# EAGLE design SAM-M8Q GPS FeatherWing (EAGLE 8.3.2)
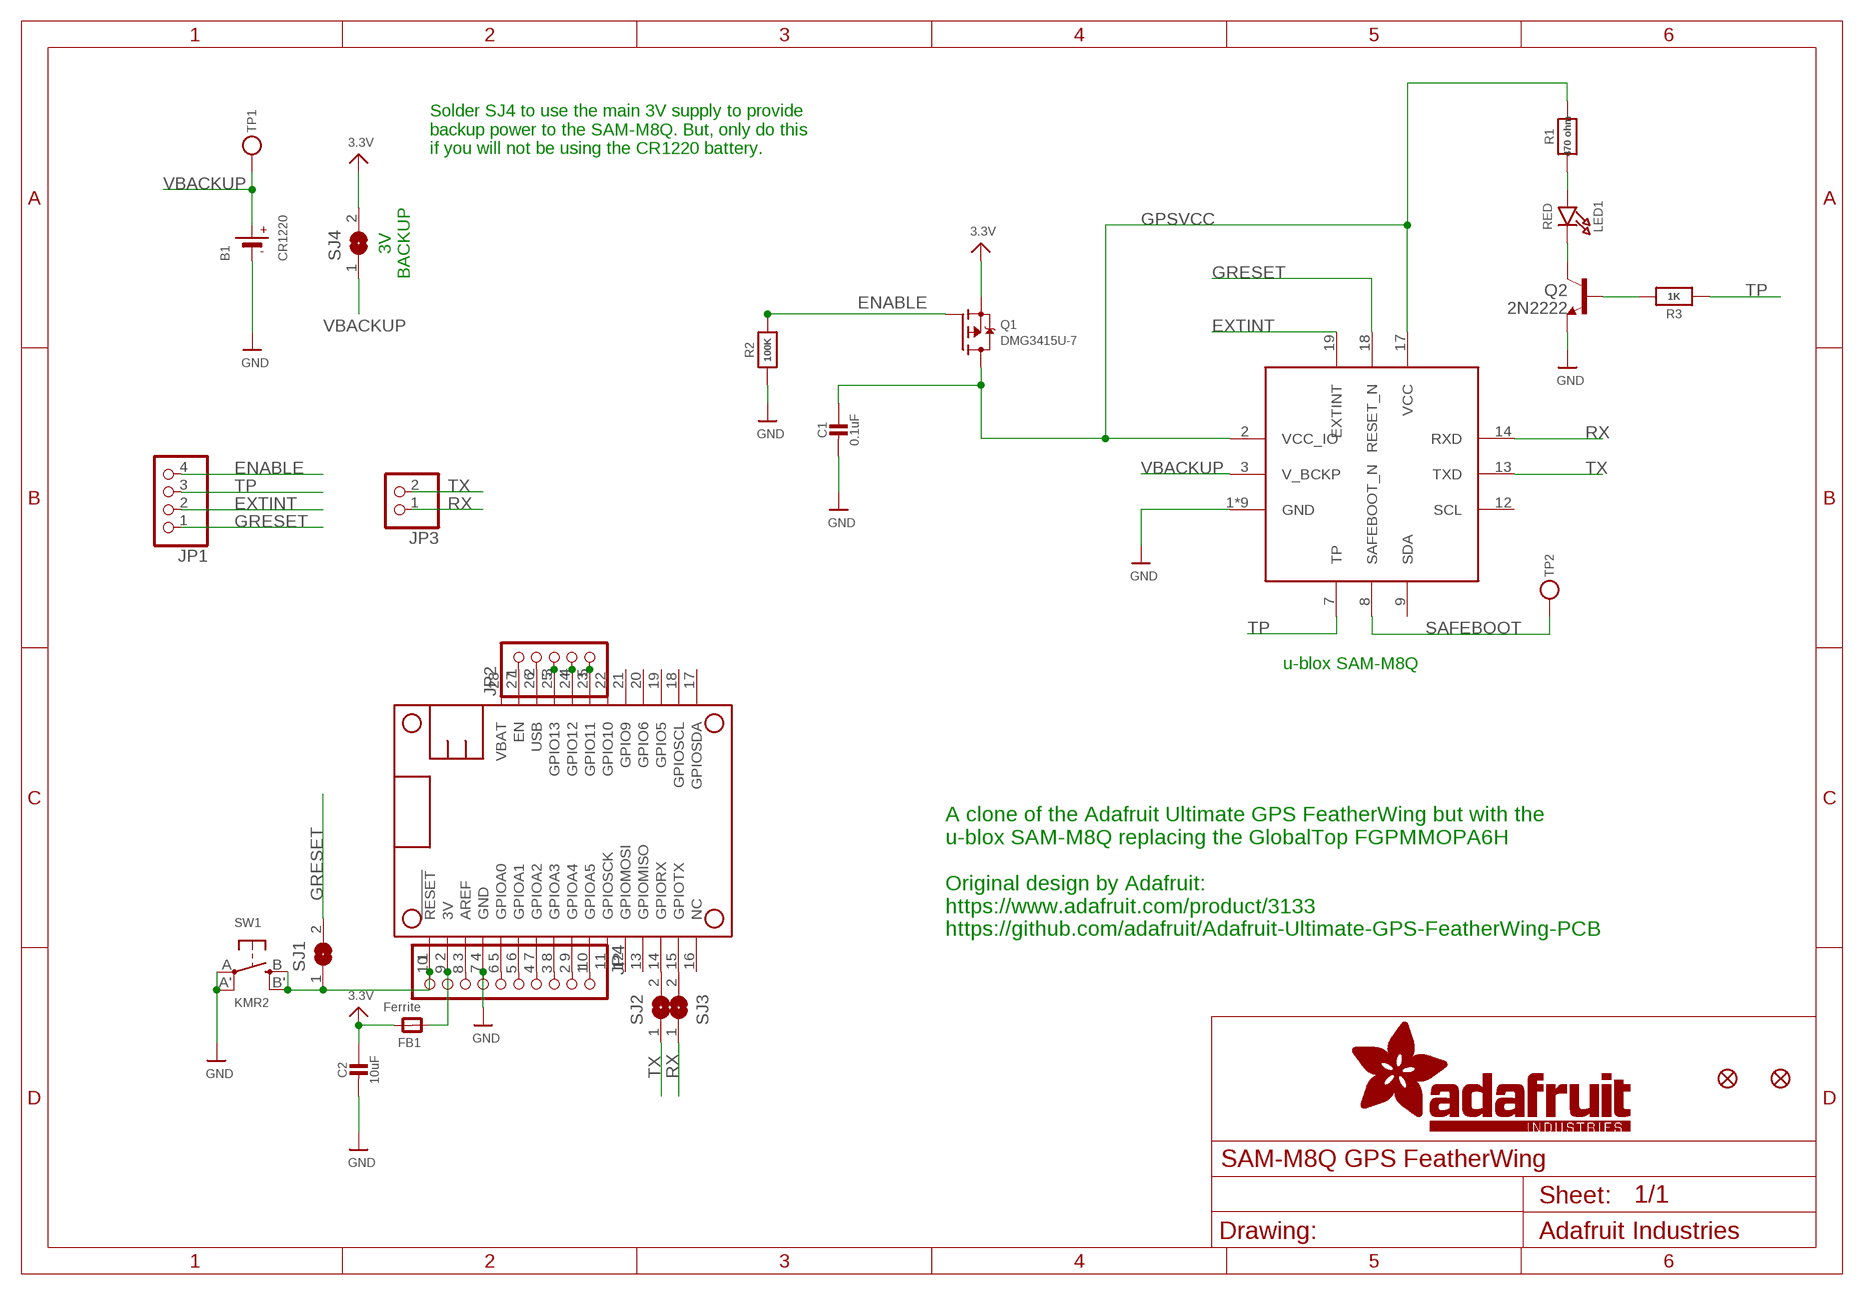
[diagram p0: schematic, sheet 1]

## Parts
B1  CR1220  BATTERYCR1220_2  [CR1220-2]
C1  0.1uF  CAP_CERAMIC0805-NOOUTLINE  [0805-NO]
C2  10uF  CAP_CERAMIC0805-NOOUTLINE  [0805-NO]
FB1  Ferrite  FERRITE-0805NO  [0805-NO]
FID1  FIDUCIAL""  [FIDUCIAL_1MM]
FID2  FIDUCIAL""  [FIDUCIAL_1MM]
JP1  HEADER-1X4ROUND  [1X04_ROUND]
JP2  HEADER-1X570MIL  [1X05_ROUND_70]
JP3  HEADER-1X2ROUND  [1X02_ROUND]
JP4  HEADER-1X10ROUND  [1X10_ROUND]
LED1  RED  LED0805_NOOUTLINE  [CHIPLED_0805_NOOUTLINE]
MS1  FEATHERWING  [FEATHERWING]
Q1  DMG3415U-7  MOSFET-PWIDE  [SOT23-WIDE]
Q2  2N2222  MMBT2222ALT1-NPN-SOT23-BEC  [SOT23-BEC]
R1  470 ohm  RESISTOR0805_NOOUTLINE  [0805-NO]
R2  100K  RESISTOR0805_NOOUTLINE  [0805-NO]
R3  1K  RESISTOR0805_NOOUTLINE  [0805-NO]
SJ1  SOLDERJUMPER  [SOLDERJUMPER_ARROW_NOPASTE]
SJ2  SOLDERJUMPERCLOSED  [SOLDERJUMPER_CLOSEDWIRE]
SJ3  SOLDERJUMPERCLOSED  [SOLDERJUMPER_CLOSEDWIRE]
SJ4  SOLDERJUMPER  [SOLDERJUMPER_ARROW_NOPASTE]
SW1  KMR2  SWITCH_TACT_SMT4.6X2.8  [BTN_KMR2_4.6X2.8]
TP1  TESTPOINTROUND1.5MM  [TESTPOINT_ROUND_1.5MM]
TP2  TESTPOINTROUND1.5MM  [TESTPOINT_ROUND_1.5MM]
U1  SAM-M8Q  [SAM-M8Q]

## Nets
3.3V: C2.1 FB1.2 Q1.2(S) SJ4.2
3V: FB1.1 JP4.9 MS1.2(3V)
ENABLE: JP1.4 Q1.1(G) R2.2
EXTINT: JP1.2 U1.19(EXTINT)
GND: B1.- C1.2 C2.2 JP4.7 MS1.4(GND) Q2.E R2.1 SW1.A'(P1) SW1.A(P) U1.1(GND) U1.4(GND) U1.5(GND) U1.6(GND) U1.10(GND) U1.11(GND) U1.15(GND) U1.16(GND) U1.20(GND)
GPSVCC: C1.1 Q1.3(D) R1.2 U1.2(VCC_IO) U1.17(VCC)
GRESET: JP1.1 SJ1.2 U1.18(RESET_N)
N$1: JP2.3 MS1.25(GPIO13)
N$2: LED1.A R1.1
N$3: JP2.4 MS1.24(GPIO12)
N$4: LED1.C Q2.C
N$5: JP2.5 MS1.23(GPIO11)
N$6: JP4.1 MS1.10(GPIOA5)
N$7: JP4.2 MS1.9(GPIOA4)
N$8: JP4.3 MS1.8(GPIOA3)
N$9: JP4.4 MS1.7(GPIOA2)
N$10: JP4.5 MS1.6(GPIOA1)
N$11: JP4.6 MS1.5(GPIOA0)
N$12: JP4.10 MS1.1(!RESET) SJ1.1 SW1.B'(S1) SW1.B(S)
N$13: JP4.8 MS1.3(AREF)
N$14: JP2.1 MS1.27(EN)
N$16: MS1.14(GPIORX) SJ2.2
N$17: MS1.15(GPIOTX) SJ3.2
N$18: Q2.B R3.2
RX: JP3.1 SJ3.1 U1.14(RXD)
SAFEBOOT: TP2.P$1 U1.8(SAFEBOOT_N)
TP: JP1.3 R3.1 U1.7(TP)
TX: JP3.2 SJ2.1 U1.13(TXD)
USB: JP2.2 MS1.26(USB)
VBACKUP: B1.+ SJ4.1 TP1.P$1 U1.3(V_BCKP)
Unconnected: MS1.11(GPIOSCK) MS1.12(GPIOMOSI) MS1.13(GPIOMISO) MS1.16(NC) MS1.17(GPIOSDA) MS1.18(GPIOSCL) MS1.19(GPIO5) MS1.20(GPIO6) MS1.21(GPIO9) MS1.22(GPIO10) MS1.28(VBAT) U1.9(SDA) U1.12(SCL)

## Notes on the sheet
- Solder SJ4 to use the main 3V supply to provide
  backup power to the SAM-M8Q. But, only do this
  if you will not be using the CR1220 battery.
- 3V
  BACKUP
- u-blox SAM-M8Q
- A clone of the Adafruit Ultimate GPS FeatherWing but with the
  u-blox SAM-M8Q replacing the GlobalTop FGPMMOPA6H
  
  Original design by Adafruit:
  https://www.adafruit.com/product/3133
  https://github.com/adafruit/Adafruit-Ultimate-GPS-FeatherWing-PCB

## Library data of the parts
B1 = microbuilder:BATTERY: CR1220 SMT - Digikey: 3001K-ND CD2032 BAT-HLD-001 - Digikey: BAT-HLD-001-ND
C1 C2 = microbuilder:CAP_CERAMIC: Ceramic Capacitors For new designs, use the packages preceded by an '_' character since they are more reliable: The following footprints should be used on most boards: _0402 - Standard footprint for regular board layouts _0603 - Standard footprint for regular board layouts _0805 - Standard footprint for regular board layouts _1206 - Standard footprint for regular board layouts For extremely tight-pitch boards where space is at a premium, the following 'micro-pitch' footprints can be used (smaller pads, no silkscreen outline, etc.): _0402MP - Micro-pitch footprint for very dense/compact boards _0603MP - Micro-pitch footprint for very dense/compact boards _0805MP - Micro-pitch footprint for very dense/compact boards _1206MP - Micro-pitch footprint for very dense/compact boards
FB1 = microbuilder:FERRITE: Ferrite Bead 0603 MMZ1608B121C - 120 Ohm @ 100MHz, 600mA, 0.15 Ohm DC Resistance - Digikey: 445-2164-1-ND BK1608HW121-T - 120 Ohm, 600mA Ferrite Chip - Digikey: 587-1876-2-ND 0805 HZ0805B272R-10 - 2.7K Ohm @ 100MHz, 200mA, 0.8 Ohm DC Resistance - Digikey: 240-2504-1-ND (see also Murata BLM21BD272SN1L) MMZ2012Y152B - 1.5K Ohm @ 100MHz, 500mA, 0.4 Ohm DC Resistance - Digikey: 445-1560-1-ND - Mainly for high frequency (80-400MHz) MMZ2012R102A - 1K Ohm @ 100MHz, 500mA, 0.3 Ohm DC Resistance - Digikey: 445-1555-2-ND - More general purpose (10-200MHz)
FID1 FID2 = microbuilder:FIDUCIAL: Fiducial Alignment Points Various fiducial points for machine vision alignment.; BOM: EXCLUDE
JP1 = microbuilder:HEADER-1X4: PIN HEADER
JP2 = microbuilder:HEADER-1X5: PIN HEADER
JP3 = microbuilder:HEADER-1X2: PIN HEADER
JP4 = microbuilder:HEADER-1X10: PIN HEADER
LED1 = microbuilder:LED: LED 0603 - 0603 Surface Mount Package 2mA: Green LED - Low Power (3.9mcd, 2ma, 1.7Vf) - Digikey: 475-2709-2-ND Orange LED - Low Power (9.8mcd, 2ma, 1.8Vf) - Digikey: 475-1194-2-ND Red LED - Low Power (5mcd, 2ma, 1.8Vf) - Digikey: 475-1195-2-ND Yellow LED - Low Power (7mcd, 2ma, 1.8Vf) - Digikey: 475-1196-2-ND 5mA: Blue LED - Low Power (17mcd, 5ma, 2.9Vf) - Digikey: LNJ937W8CRACT-ND 0805 - 0805 Surface Mount Package 2mA: Red LED (8.8mcd, 2mA, 1.8Vf, Clear) - Low Power [Digikey: 475-2510-1-ND] Green LED (5mcd, 2mA, 1.8Vf, Clear) - Low Power [Digikey: 475-2730-1-ND] Yellow LED (11.3mcd, 2mA, 1.8Vf, Clear) - Low Power [Digikey: 475-2555-1-ND] 20mA: Red LED (104mcd, 20mA, Diffused) - LS R976 [Digikey: 475-1278-6-ND] Red LED (12mcd, 20mA, 2.0Vf, Clear) - APT2012EC [Digikey: 754-1128-1-ND] Green LED (15mcd, 20mA, 2.2Vf, Clear) - APT2012GC [Digikey: 754-1131-1-ND] Orange LED (160mcd, 20mA, 2.1Vf, Clear) - APT2012SECK [Digikey: 754-1130-1-ND] 1206 - 1206 Surface Mount Package Green LED (26mcd, 20mA, Diffused) - LG N971 [Digikey: 475-1407-6-ND] Red LED (15mcd, 20mA, Diffused) - LH N974 [Digikey: 475-1416-6-ND] Cree - Cree High-Power Surface Mount LEDs XPEBWT-L1-0000-00D50 - White 111lm 350mA 2.9Vf 6200K 110° XTEAWT-00-0000-00000LEE3 - White 114lm 350mA 2.85Vf 5000K 115° Everlight - Everlight 45-21 Series Surface Mount LEDs 45-21/QK2C-B2832AC2CB2/2T - Warm White 2000mcd 20mA 3.25Vf 3050K 120° 45-21/LK2C-B38452C4CB2/2T - Nuetral White 2000mcd 20mA 3.25Vf 4150K 120° 45-21/LK2C-B50634C6CB2/2T - Cold White 2200mcd 20mA 3.25Vf 5650K 120° PLCC2 Reverse Mount LS T77K-J1L2-1-0-2-R18-Z - Red 11.25mcd 2mA 1.8Vf 630nm 120° LO T77K-L1M2-24-Z - Orange 19.6mcd 2mA 1.8Vf 606nm 120° LY T77K-K2M1-26-Z - Yellow 15.7mcd 2mA 1.8Vf 587nm 120°
MS1 = microbuilder:FEATHERWING
Q1 = microbuilder:MOSFET-P: P-Channel Mosfet LEGEND VDS: Voltage Drain-Source ID: Drain Current RDS(ON): Drain-Source On-State Resistance VGS(TH): Gate-Source Threshold Voltage CISS: Drain-Source Input Capacitance SOT-23 Name VDS ID RDS(ON) VGS(TH) CISS Order Number IRLML5103 30V 760mA 600 mOhm -- 75pF @ 25V Digikey: IRLML5103PBFCT-ND IRLML6401 12V 4.3A 50 mOhm 950mV @ 250µA 830pF @ 10V Digikey: IRLML6401PBFTR-ND NTR0202PL 20V 400mA 800 mOhm 2.3V @ 250uA 70pF @ 5V Digikey: NTR0202PLT1GOSTR-ND NTR4101PT1G 20V 1.8A 85 mOhm 1.2V @ 250uA 675pF @ 10V Digikey: NTR4101PT1GOSCT-ND DMP2004K 20V 600mA 900 mOhm 1V @ 250uA 175pF @ 16V Digikey: DMP2004KDICT-ND PMV65XP 20V 3.9A 76 mOhm 950mV @ 1mA 725pF @ 20V Digikey: 568-2358-2-ND TO-252 Name VDS ID RDS(ON) VGS(TH) CISS Order Number AOD417 30V 25A 34 mOhm 3V @ 250µA 920pF @ 15V Digikey: 785-1106-2-ND
Q2 = transistor:*-NPN-: NPN Transistror BF959 corrected 2008.03.06
R1-R3 = microbuilder:RESISTOR: Resistors For new designs, use the packages preceded by an '_' character since they are more reliable: The following footprints should be used on most boards: _0402 - Standard footprint for regular board layouts _0603 - Standard footprint for regular board layouts _0805 - Standard footprint for regular board layouts _1206 - Standard footprint for regular board layouts For extremely tight-pitch boards where space is at a premium, the following 'micro-pitch' footprints can be used (smaller pads, no silkscreen outline, etc.): _0402MP - Micro-pitch footprint for very dense/compact boards _0603MP - Micro-pitch footprint for very dense/compact boards _0805MP - Micro-pitch footprint for very dense/compact boards _1206MP - Micro-pitch footprint for very dense/compact boards
SJ1 SJ4 = microbuilder:SOLDERJUMPER: SMD Solder JUMPER Solder the two pads together to create a connection, or remove the solder to break it. REFLOW - Use this footprint for solder paste and reflow ovens. WAVE - Use this footprint for hand-soldering (larger pads). CLOSED - Has a trace between the two pads to ensure it is closed by default. The trace needs to be cut to disable the jumper, and can be closed again by creating a solder bridge between the two pads.; BOM: EXCLUDE
SJ2 SJ3 = microbuilder:SOLDERJUMPER: SMD Solder JUMPER Solder the two pads together to create a connection, or remove the solder to break it. REFLOW - Use this footprint for solder paste and reflow ovens. WAVE - Use this footprint for hand-soldering (larger pads). CLOSED - Has a trace between the two pads to ensure it is closed by default. The trace needs to be cut to disable the jumper, and can be closed again by creating a solder bridge between the two pads.
SW1 = microbuilder:SWITCH_TACT_SMT: SMT Tact Switches 6x6mm - Digikey: P12940SCT-ND KMR2 (4.6x2.8mm) - Digikey: 401-1426-1-ND EVQ-PQHB55 - Light Touch, 160GF (4.5x4.5mm) - Digikey: P8090SCT-ND KMT0 - KMT021 NGJ LHS (etc.) IP68/Waterproof - Digikey: CKN10289CT-ND
TP1 TP2 = microbuilder:TESTPOINT: Test Point Various test points for characterisation and PCB testing TESTPOINT_SMT - Compact Surface Mount Test Point [Digikey: 5016KTR-ND]
U1 = ubloxLib:SAM-M8Q: u-blox SAM GNSS antenna module

## Board
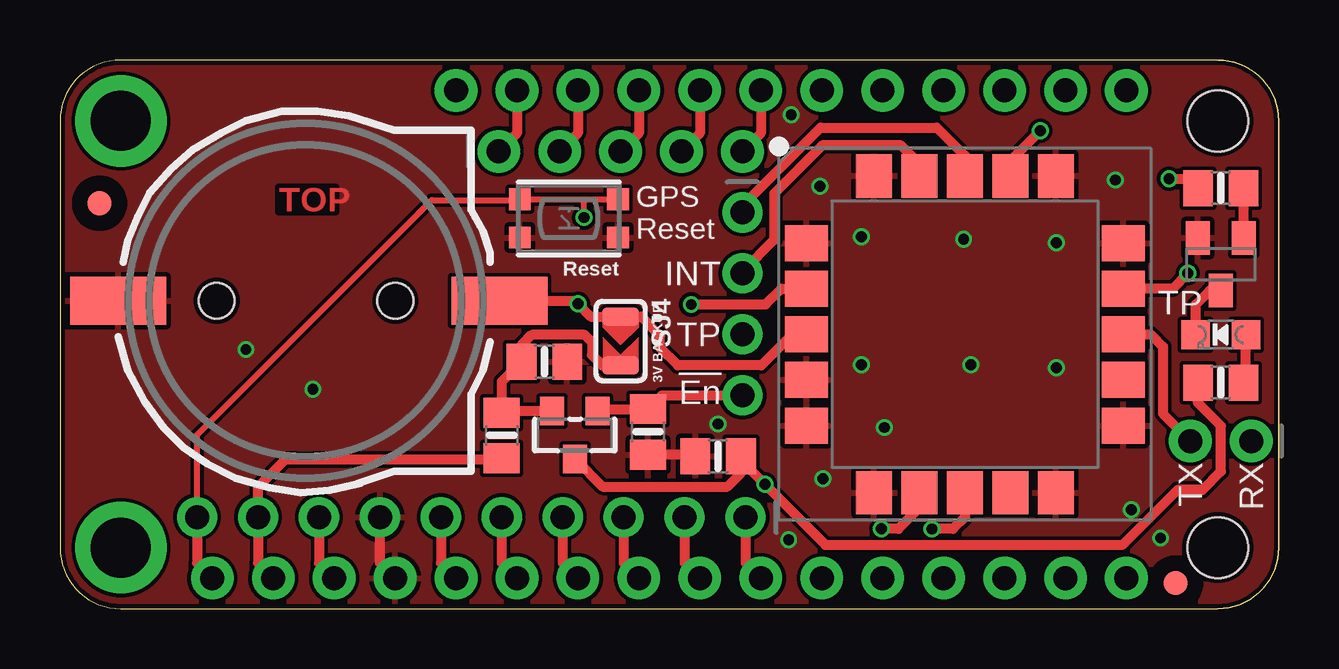
[diagram p1: board, top side]
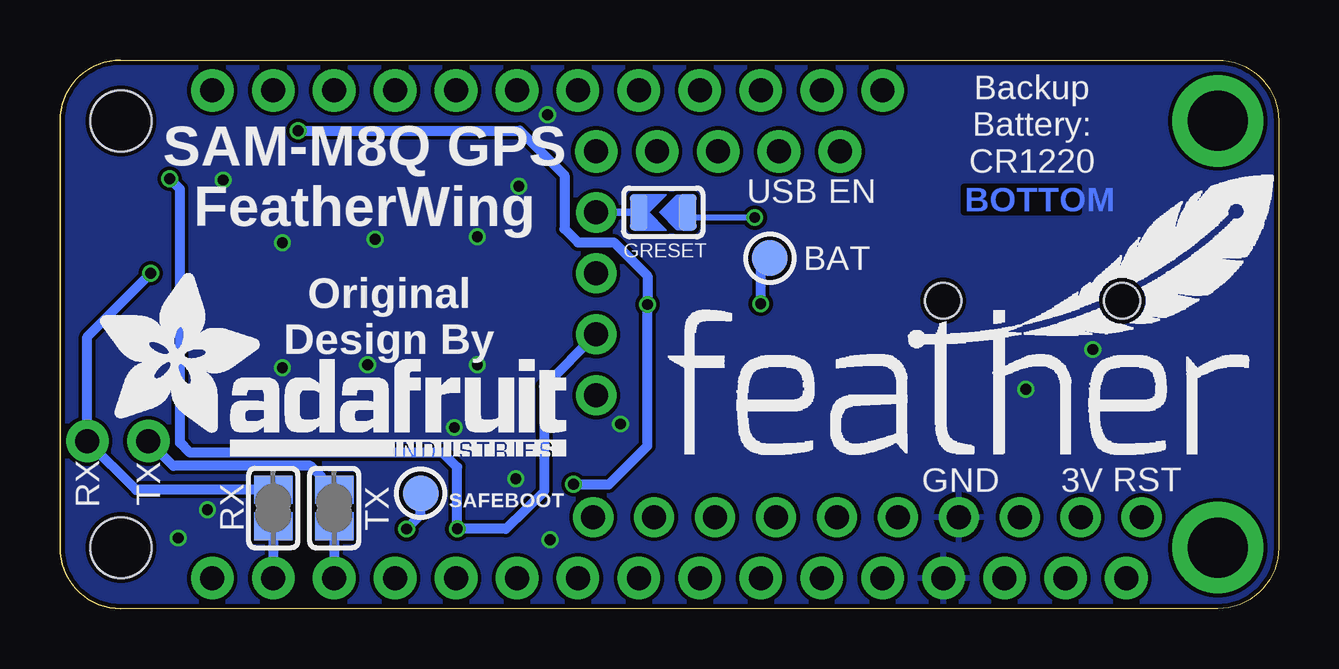
[diagram p2: board, bottom side, seen from below]

Size 50.8 x 22.86 mm. Coordinates in mm from the lower left corner, seen from the top.
Outline: 48.26,22.86 arc-90 50.8,20.32 50.8,2.54 arc-90 48.26,0
Copper layers (1*16): Top 0.018mm / dielectric 1.55mm / Bottom 0.018mm
Design rules "Multi-CB_2L_125um-Tracks_OL35um *": minimum track width 0.125mm, minimum drill 0.2mm, track to track 0.125mm, track to pad 0.125mm, pad to pad 0.125mm, via to via 0.125mm, smd to smd 0mil, copper to edge 0.2mm, drill to drill 0.2mm, minimum pad ring 0.125mm, minimum via ring 0.125mm, stop-mask expansion 2mil, vias tented up to drill 0.45mm, thermal gap 0.2mm

### Footprints (pad centres in the part's own frame; a part is rotated, then mirrored left to right if it is on the bottom)
CR1220-2 = smd 4 x 2: + 8.29,0; - -7.6,0 | hole 1.5: 3.95,0; -3.5,0
0805-NO = smd 1.24 x 1.5: 1 -0.95,0; 2 0.95,0
FIDUCIAL_1MM = smd 1 x 1: 1 0,0
1X04_ROUND = drill 1 pad 1.676: 1 -3.81,0; 2 -1.27,0; 3 1.27,0; 4 3.81,0
1X05_ROUND_70 = drill 1 pad 1.778: 1 -5.08,0; 2 -2.54,0; 3 0,0; 4 2.54,0; 5 5.08,0
1X02_ROUND = drill 1 pad 1.778: 1 -1.27,0; 2 1.27,0
1X10_ROUND = drill 1 pad 1.676: 1 -11.43,0; 2 -8.89,0; 3 -6.35,0; 4 -3.81,0; 5 -1.27,0; 6 1.27,0; 7 3.81,0; 8 6.35,0; 9 8.89,0; 10 11.43,0
CHIPLED_0805_NOOUTLINE = smd 1.2 x 1.2: A 0,-1.05; C 0,1.05
FEATHERWING = drill 1 pad 1.778: 1 6.35,1.27; 2 8.89,1.27; 3 11.43,1.27; 4 13.97,1.27; 5 16.51,1.27; 6 19.05,1.27; 7 21.59,1.27; 8 24.13,1.27; 9 26.67,1.27; 10 29.21,1.27; 11 31.75,1.27; 12 34.29,1.27; 13 36.83,1.27; 14 39.37,1.27; 15 41.91,1.27; 16 44.45,1.27; 17 44.45,21.59; 18 41.91,21.59; 19 39.37,21.59; 20 36.83,21.59; 21 34.29,21.59; 22 31.75,21.59; 23 29.21,21.59; 24 26.67,21.59; 25 24.13,21.59; 26 21.59,21.59; 27 19.05,21.59; 28 16.51,21.59 | drill 2.5 pad 3.81: P$1 2.54,20.32; P$2 2.54,2.54 | hole 2.54: 48.26,20.32; 48.26,2.54
SOT23-WIDE = smd 1 x 1.2: 1 -0.95,-1; 2 0.95,-1; 3 0,1
SOT23-BEC = smd 1 x 1.4: B -0.95,-1.1; C 0,1.1; E 0.95,-1.1
SOLDERJUMPER_ARROW_NOPASTE = smd 0.762 x 1.524: 1 -1.016,0; 2 1.016,0
SOLDERJUMPER_CLOSEDWIRE = smd 1.168 x 1.6: 1 -0.762,0; 2 0.762,0 | smd 0.635 x 0.203: WIRE 0,0
BTN_KMR2_4.6X2.8 = smd 0.9 x 0.9: A 2.05,0.8; A' -2.05,0.8; B 2.05,-0.8; B' -2.05,-0.8
TESTPOINT_ROUND_1.5MM = smd 1.5 x 1.5: P$1 0,0
SAM-M8Q = smd 1.8 x 1.5: 1 -6.6,3.8; 2 -6.6,1.9; 3 -6.6,0; 4 -6.6,-1.9; 5 -6.6,-3.8; 11 6.6,-3.8; 12 6.6,-1.9; 13 6.6,0; 14 6.6,1.9; 15 6.6,3.8 | smd 1.5 x 1.8: 6 -3.8,-6.6; 7 -1.9,-6.6; 8 0,-6.6; 9 1.9,-6.6; 10 3.8,-6.6; 16 3.8,6.6; 17 1.9,6.6; 18 0,6.6; 19 -1.9,6.6; 20 -3.8,6.6

### Placement (x,y rotation side)
B1  10.03,12.83 0 top
C1  27.43,6.35 180 top
C2  20.19,10.29 0 top
FB1  18.41,7.21 90 top
FID1  1.65,16.89 0 top
FID2  46.51,1.06 0 top
JP1  28.45,12.7 270 top
JP2  23.37,19.05 0 top
JP3  48.39,6.99 180 top
JP4  17.14,3.81 180 top
LED1  48.39,11.42 90 top
MS1  0,0 0 top
Q1  21.46,7.24 180 top
Q2  48.39,14.35 180 top
R1  48.39,9.42 180 top
R2  24.51,7.37 90 top
R3  48.39,17.53 0 top
SJ1  25.65,16.51 180 bottom
SJ2  39.37,4.19 270 bottom
SJ3  41.91,4.19 270 bottom
SJ4  23.37,11.15 270 top
SW1  21.21,16.26 180 top
TP1  21.21,14.61 0 bottom
TP2  35.76,4.8 0 bottom
U1  37.72,11.43 0 top
U$11  [ADAFRUIT_TEXT_20MM]  49.28,6.35 0 bottom

### Tracks (layer width: path | path; a pad name or v marks a point on that pad's centre or on a via)
3.3V
  Top 0.406: Q1.2 18.49,8.24 FB1.2 18.41,9.46 C2.1 19.28,10.32 19.28,11.02 19.66,11.4 21.87,11.4 22.17,11.1 22.17,10.57 22.61,10.13 SJ4.2
3V
  Top 0.406: MS1.2 8.26,1.91 JP4.9 8.26,5.08 9.4,6.22 18.37,6.22 FB1.1
ENABLE
  Top 0.406: Q1.1 22.49,8.32 R2.2 25.09,8.89 JP1.4
EXTINT
  Top 0.406: U1.19 35.81,18.54 35.05,19.3 31.77,19.3 29.77,17.3 29.77,15.37 28.45,14.05 JP1.2
GND  (via drill 0.45)
  Top 0.406: MS1.4 13.34,1.91 JP4.7 | C1.2 26.42,6.42 R2.1
  other vias: 7.75,10.79 10.54,9.14 27.43,7.7 31.67,17.6 31.8,5.41 37.97,10.16 41.53,15.24 45.87,2.95 33.4,15.49 37.67,15.39 33.4,10.16 43.99,17.86 41.53,10.03 44.65,4.11 30.38,2.87 30.48,20.57 34.37,7.54
  pour Top (isolate 0.152): 0,22.86 0,0 50.8,0 50.8,22.86
  pour Bottom (isolate 0.152): 0,22.86 0,0 50.8,0 50.8,22.86
GPSVCC  (via drill 0.45)
  Top 0.406: Q1.3 22.62,5.08 27.81,5.08 28.38,5.65 C1.1 28.38,6.19 v29.39,5.18 31.9,2.67 31.9,2.64 44.27,2.64 46.58,4.95 47.62,4.95 48.39,5.71 48.39,7.62 47.44,8.57 R1.2 | v26.31,12.68 29.41,12.68 30.07,13.33 U1.2 | U1.17 39.62,18.66 v40.87,19.91
  Bottom 0.406: v29.39,5.18 27.91,5.18 26.31,6.78 v26.31,12.68 26.31,13.87 27.71,15.27 29.21,15.27 29.77,15.82 29.77,18.06 31.62,19.91 v40.87,19.91
GRESET
  Top 0.406: JP1.1 28.45,16.79 31.7,20.04 36.55,20.04 37.72,18.87 U1.18
  Bottom 0.305: JP1.1 SJ1.2
N$1
  Top 0.406: MS1.25 24.13,19.81 JP2.3
N$2
  Top 0.406: R1.1 49.44,9.52 LED1.A
N$3
  Top 0.406: MS1.24 26.67,19.81 JP2.4
N$4
  Top 0.406: LED1.C 47.34,12.67 47.92,13.25 Q2.C
N$5
  Top 0.406: MS1.23 29.21,19.81 JP2.5
N$6
  Top 0.406: JP4.1 28.57,1.91 MS1.10
N$7
  Top 0.406: JP4.2 26.04,1.91 MS1.9
N$8
  Top 0.406: JP4.3 23.5,1.91 MS1.8
N$9
  Top 0.406: JP4.4 20.95,1.91 MS1.7
N$10
  Top 0.406: JP4.5 18.41,1.91 MS1.6
N$11
  Top 0.406: JP4.6 15.88,1.91 MS1.5
N$12  (via drill 0.45)
  Top 0.254: JP4.10 5.71,7.24 15.49,17.02 19.12,17.02 SW1.B 21.84,17.06 | 21.84,17.06 SW1.B' | v21.84,16.29 21.84,17.06
  Top 0.406: JP4.10 5.71,1.91 MS1.1
  Bottom 0.254: v21.84,16.29 24.42,16.29 SJ1.1
N$13
  Top 0.406: JP4.8 10.79,1.91 MS1.3
N$14
  Top 0.406: MS1.27 19.05,19.81 JP2.1
N$16
  Bottom 0.406: SJ2.2 MS1.14
N$17
  Bottom 0.406: SJ3.2 MS1.15
N$18
  Top 0.406: Q2.B R3.2
RX  (via drill 0.45)
  Top 0.406: U1.14 46.38,13.33 v47.02,13.97
  Bottom 0.406: SJ3.1 47.62,4.95 JP3.1 49.66,11.33 v47.02,13.97
SAFEBOOT  (via drill 0.45)
  Top 0.406: U1.8 37.72,3.81 37.23,3.32 v36.35,3.32
  Bottom 0.406: v36.35,3.32 35.76,3.9 TP2.P$1
TP  (via drill 0.45)
  Top 0.406: v46.23,17.91 47.06,17.91 R3.1 | U1.7 35.82,4.2 34.95,3.33 v34.24,3.33
  Bottom 0.406: v46.23,17.91 45.8,17.48 45.8,6.91 45.39,6.5 34.85,6.5 34.24,5.89 v34.24,3.33 32.21,3.33 30.63,4.88 30.63,9.25 JP1.3
TX
  Top 0.406: U1.13 45.47,11.43 45.97,10.92 45.97,8.13 JP3.2
  Bottom 0.406: SJ2.1 40.36,5.94 46.08,5.94 JP3.2
USB
  Top 0.406: MS1.26 21.59,19.81 JP2.2
VBACKUP  (via drill 0.45)
  Top 0.406: B1.+ 21.46,12.83 v21.59,12.7 22.12,12.17 SJ4.1 24.23,12.17 25.02,11.38 25.02,10.87 25.76,10.13 29.23,10.13 30.53,11.43 U1.3
  Bottom 0.406: v21.59,12.7 21.59,14.22 TP1.P$1

### Text on the board
Top: TOP
Bottom: BOTTOM
tPlace: GPS / Reset | Reset | INT | TP | TP | !En | 3V BACKUP | TX | RX
bPlace: Backup / Battery: / CR1220 | SAM-M8Q GPS / FeatherWing | EN | USB | BAT | GRESET | Original / Design By | RST | 3V | GND | SAFEBOOT | TX | RX | TX | RX
tDocu: R3 | B1 | Q2 | SW1 | C2 | U1 | LED1 | R2 | R1 | FB1 | Q1 | C1 | JP3